# Altium schematic sheet Boost Converter.SchDoc
size A4; SheetNumber: 1; SheetTotal: 1
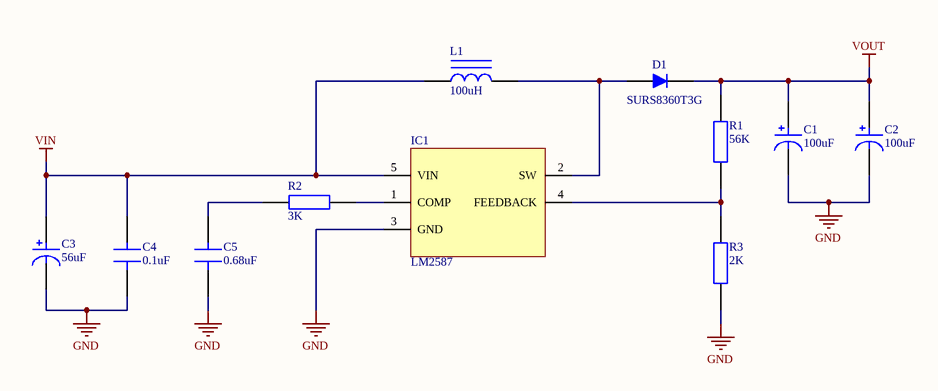
[diagram p0: Boost Converter.SchDoc]

## Parts
C1  100uF  [EEE-FK1H101P]
C2  100uF  [EEE-FK1H101P]
C3  56uF  [UWD1V560MCL1GS]
C4  0.1uF  [CAP-0805]
C5  0.68uF  [CAP-0805]
D1  SURS8360T3G  [SURS8360]
IC1  LM2587  [D2PAK]
L1  100uH  [7447070]
R1  56K  [RES-0805]
R2  3K  [RES-0805]
R3  2K  [RES-0805]

## Nets
GND: C1.2 C2.2 C3.2 C4.1 C5.1 IC1.3(GND) R3.1
VIN: C3.1 C4.2 IC1.5(VIN) L1.1
VOUT: C1.1 C2.1 D1.2 R1.2
NetC5_2: C5.2 R2.1
NetD1_1: D1.1 IC1.2(SW) L1.2
NetIC1_1: IC1.1(COMP) R2.2
NetIC1_4: IC1.4(FEEDBACK) R1.1 R3.2